# Altium schematic sheet Э3_4.SchDoc
size 420 x 297 mm; SheetNumber: 4; Scale: 1:1; DocumentType: Схема электрическая принципиальная
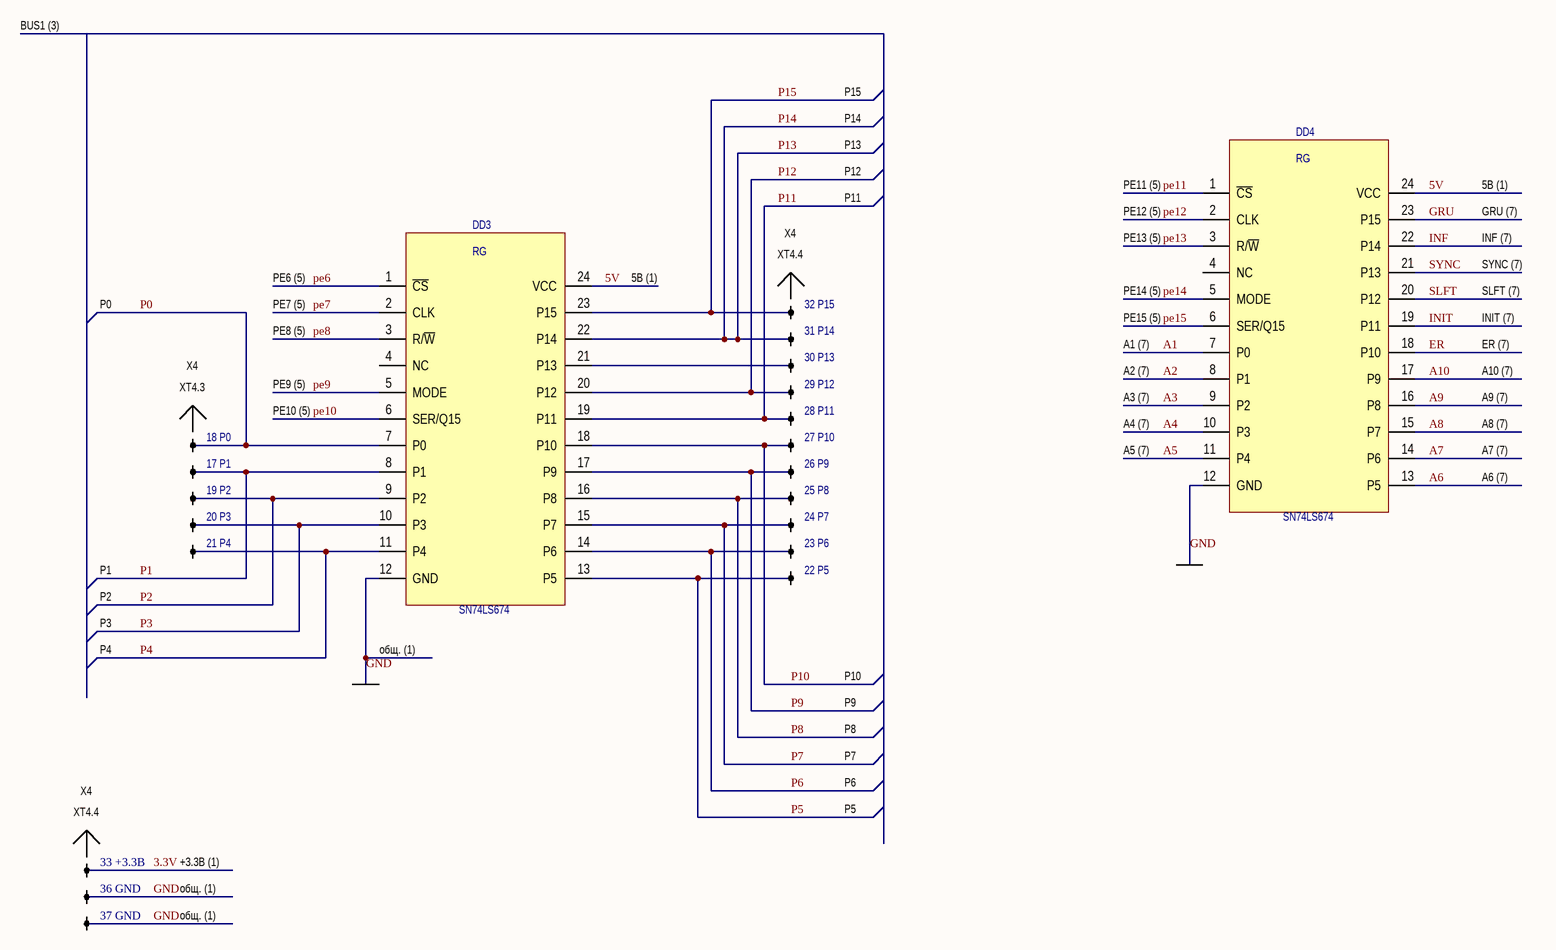
[diagram p0: Э3_4.SchDoc]

## Parts
DD3  SN74LS674  [SOP127P1030X265-24N]
DD4  SN74LS674  [SOP127P1030X265-24N]
X4  17 P1  [PLD40]  (parts Q,R,S,T,U,V,W,X,Y,Z,27,28,29,30,31,32,33,36,37 of 40)

## Nets
3.3V: X4.33
5V: DD3.24(VCC) DD4.24(VCC)
A1: DD4.7(P0)
A2: DD4.8(P1)
A3: DD4.9(P2)
A4: DD4.10(P3)
A5: DD4.11(P4)
A6: DD4.13(P5)
A7: DD4.14(P6)
A8: DD4.15(P7)
A9: DD4.16(P8)
A10: DD4.17(P9)
ER: DD4.18(P10)
GND: DD3.12(GND) DD4.12(GND) X4.36 X4.37
GRU: DD4.23(P15)
INF: DD4.22(P14)
INIT: DD4.19(P11)
P0: DD3.7(P0) X4.32
P1: DD3.8(P1) X4.31
P2: DD3.9(P2) X4.33
P3: DD3.10(P3) X4.34
P4: DD3.11(P4) X4.35
P5: DD3.13(P5) X4.36
P6: DD3.14(P6) X4.37
P7: DD3.15(P7) X4.38
P8: DD3.16(P8) X4.39
P9: DD3.17(P9) X4.40
P10: DD3.18(P10) X4.2
P11: DD3.19(P11) X4.3
P12: DD3.20(P12) X4.4
P13: DD3.22(P14) X4.6  [also labelled P14]
P15: DD3.23(P15) X4.7
pe6: DD3.1(~{CS})
pe7: DD3.2(CLK)
pe8: DD3.3(R/~{W})
pe9: DD3.5(MODE)
pe10: DD3.6(SER/Q15)
pe11: DD4.1(~{CS})
pe12: DD4.2(CLK)
pe13: DD4.3(R/~{W})
pe14: DD4.5(MODE)
pe15: DD4.6(SER/Q15)
SLFT: DD4.20(P12)
SYNC: DD4.21(P13)
NetDD3_21: DD3.21(P13) X4.5

Not connected (* = marked no-connect by the designer): DD3 4(NC); DD4 4(NC)

## Notes on the sheet
- BUS1 (3)
- P15
- P12
- P13
- P14
- PE11 (5)
- 5В (1)
- (near X4) XT4.4
- X4
- P11
- PE12 (5)
- PE13 (5)
- INF (7)
- GRU (7)
- P0
- PE6 (5)
- PE7 (5)
- PE14 (5)
- PE15 (5)
- SYNC (7)
- SLFT (7)
- INIT (7)
- (near X4) XT4.3
- PE8 (5)
- PE9 (5)
- A1 (7)
- A2 (7)
- A10 (7)
- ER (7)
- PE10 (5)
- A3 (7)
- A4 (7)
- A5 (7)
- A9 (7)
- A8 (7)
- A7 (7)
- A6 (7)
- P1
- P2
- P3
- P4
- общ. (1)
- P9
- P10
- P6
- P7
- P8
- P5
- +3.3В (1)
- Подп. и дата
- Инв. № дубл.
- Взам. инв. №
- Инв. № подл.
- Изм.
- Лист
- № докум.
- Подп.
- Дата
- 2.106-A3
- Копировал
- Формат А3
- (in symbol SN74LS674) RG

## Library data of the parts
X4 = PLD40